# EAGLE design led_backpack_5947_alt (EAGLE 5.06)
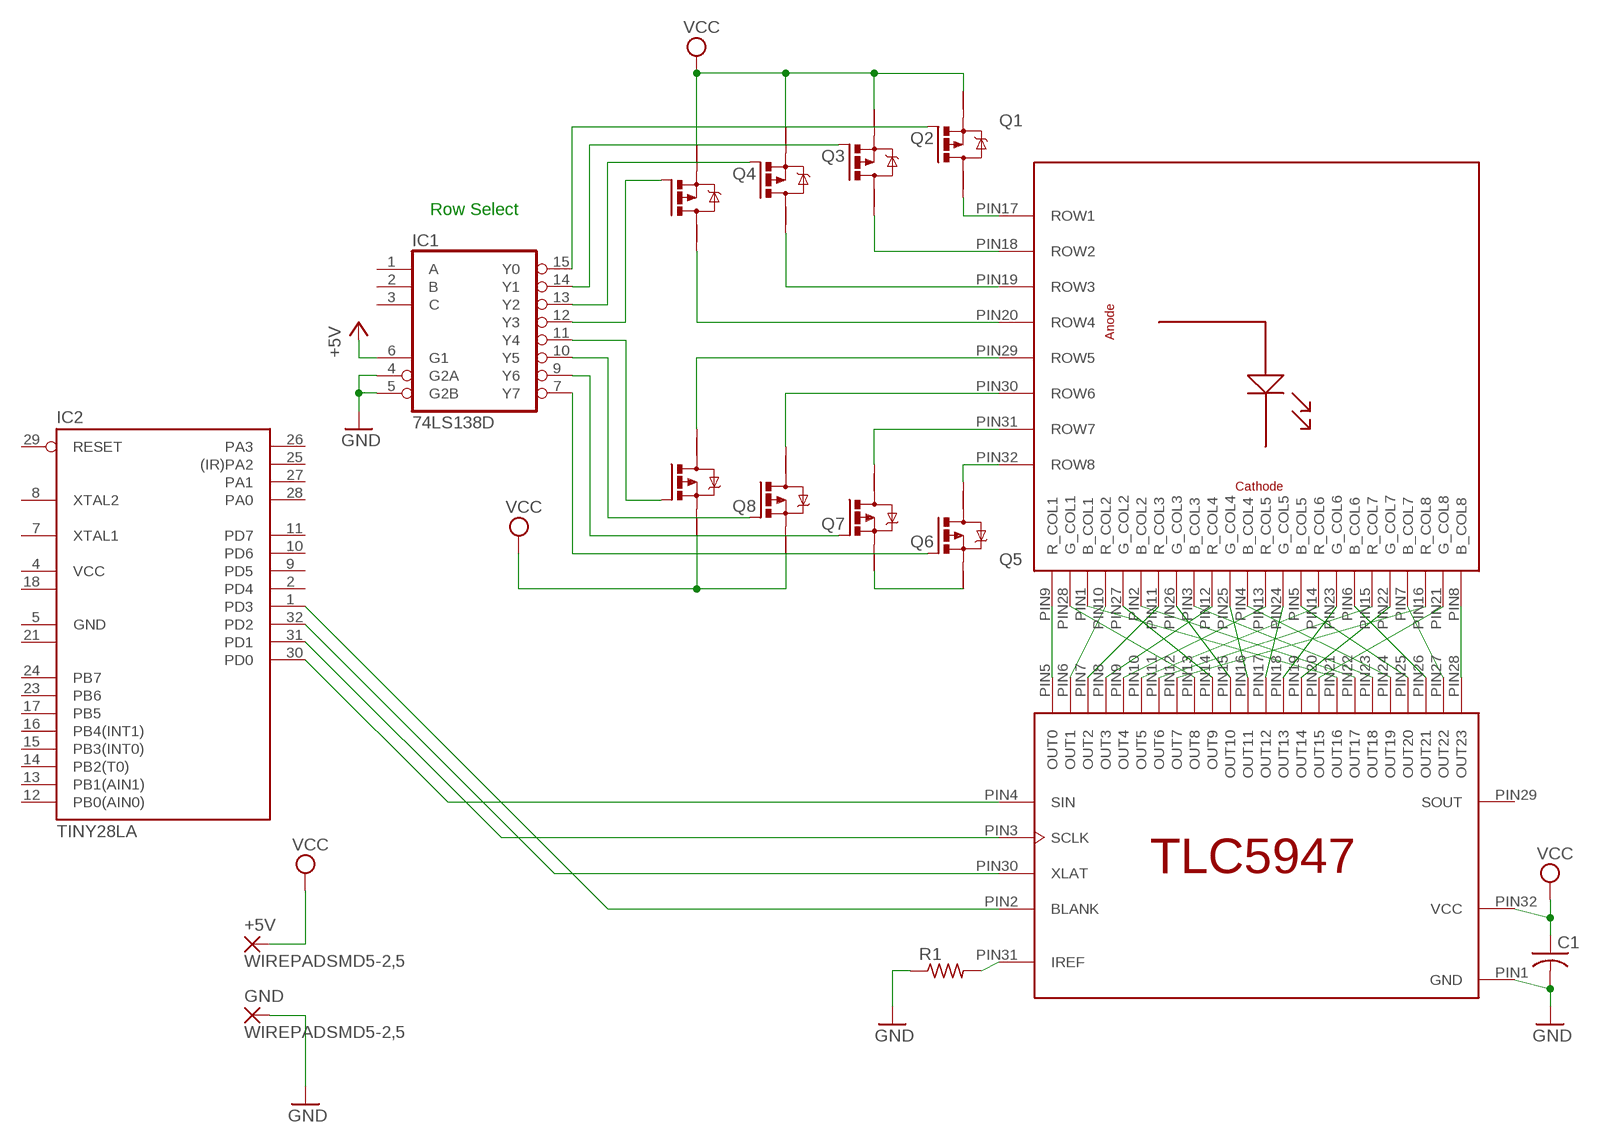
[diagram p0: schematic, sheet 1]

## Parts
+5V  WIREPADSMD5-2,5  [5-2,5]
C1  C-US075-042X103  [C075-042X103]
GND  WIREPADSMD5-2,5  [5-2,5]
IC1  74LS138D  [SO16]
IC2  TINY28LA  [TQFP32-08]
Q1  P-MOSFET-SO8  [SO-08]
Q2  P-MOSFET-SO8  [SO-08]
Q3  P-MOSFET-SO8  [SO-08]
Q4  P-MOSFET-SO8  [SO-08]
Q5  P-MOSFET-SO8  [SO-08]
Q6  P-MOSFET-SO8  [SO-08]
Q7  P-MOSFET-SO8  [SO-08]
Q8  P-MOSFET-SO8  [SO-08]
R1  R-US_0204/7  [0204/7]
U$1  TLC5947  [HTSSOP-DAP-32]
U$2  LEDSEE_LED_MATRIX_RGB  [LEDSEE_LED_MATRIX]

## Nets
+5V: IC1.6(G1)
GND: C1.2 GND.1(P) IC1.4(G2A) IC1.5(G2B) R1.1 U$1.PIN1(GND)
N$1: Q5.1(S) Q6.1(S)
N$2: U$1.PIN5(OUT0) U$2.PIN9(R_COL1)
N$3: U$1.PIN6(OUT1) U$2.PIN10(R_COL2)
N$4: U$1.PIN7(OUT2) U$2.PIN11(R_COL3)
N$5: U$1.PIN10(OUT5) U$2.PIN14(R_COL6)
N$6: U$1.PIN8(OUT3) U$2.PIN12(R_COL4)
N$7: U$1.PIN9(OUT4) U$2.PIN13(R_COL5)
N$8: U$1.PIN11(OUT6) U$2.PIN15(R_COL7)
N$9: U$1.PIN12(OUT7) U$2.PIN16(R_COL8)
N$10: U$1.PIN13(OUT8) U$2.PIN28(G_COL1)
N$11: U$1.PIN14(OUT9) U$2.PIN27(G_COL2)
N$12: U$1.PIN15(OUT10) U$2.PIN26(G_COL3)
N$13: U$1.PIN16(OUT11) U$2.PIN25(G_COL4)
N$14: U$1.PIN17(OUT12) U$2.PIN24(G_COL5)
N$15: Q1.5(D) U$2.PIN17(ROW1)
N$16: IC1.15(Y0) Q1.4(G)
N$17: IC1.14(Y1) Q2.4(G)
N$18: IC1.13(Y2) Q3.4(G)
N$19: IC1.12(Y3) Q4.4(G)
N$20: Q2.5(D) U$2.PIN18(ROW2)
N$21: Q3.5(D) U$2.PIN19(ROW3)
N$22: Q4.5(D) U$2.PIN20(ROW4)
N$23: Q5.5(D) U$2.PIN32(ROW8)
N$24: Q6.5(D) U$2.PIN31(ROW7)
N$25: Q7.5(D) U$2.PIN30(ROW6)
N$26: Q8.5(D) U$2.PIN29(ROW5)
N$27: IC1.7(Y7) Q5.4(G)
N$28: IC1.9(Y6) Q6.4(G)
N$29: U$1.PIN18(OUT13) U$2.PIN23(G_COL6)
N$30: U$1.PIN19(OUT14) U$2.PIN22(G_COL7)
N$31: U$1.PIN20(OUT15) U$2.PIN21(G_COL8)
N$32: U$1.PIN21(OUT16) U$2.PIN1(B_COL1)
N$33: U$1.PIN22(OUT17) U$2.PIN2(B_COL2)
N$34: U$1.PIN23(OUT18) U$2.PIN3(B_COL3)
N$35: U$1.PIN24(OUT19) U$2.PIN4(B_COL4)
N$36: U$1.PIN25(OUT20) U$2.PIN5(B_COL5)
N$37: U$1.PIN26(OUT21) U$2.PIN6(B_COL6)
N$38: U$1.PIN27(OUT22) U$2.PIN7(B_COL7)
N$39: IC1.10(Y5) Q7.4(G)
N$40: IC1.11(Y4) Q8.4(G)
N$41: R1.2 U$1.PIN31(IREF)
N$44: U$1.PIN28(OUT23) U$2.PIN8(B_COL8)
N$45: IC2.30(PD0) U$1.PIN4(SIN)
N$46: IC2.31(PD1) U$1.PIN3(SCLK)
N$47: IC2.32(PD2) U$1.PIN30(XLAT)
N$48: IC2.1(PD3) U$1.PIN2(BLANK)
VCC: +5V.1(P) C1.1 Q1.1(S) Q2.1(S) Q3.1(S) Q4.1(S) Q7.1(S) Q8.1(S) U$1.PIN32(VCC)
Unconnected: IC1.1(A) IC1.2(B) IC1.3(C) IC2.2(PD4) IC2.3(NC1) IC2.6(NC2) IC2.7(XTAL1) IC2.8(XTAL2) IC2.9(PD5) IC2.10(PD6) IC2.11(PD7) IC2.12(PB0(AIN0)) IC2.13(PB1(AIN1)) IC2.14(PB2(T0)) IC2.15(PB3(INT0)) IC2.16(PB4(INT1)) IC2.17(PB5) IC2.19(NC3) IC2.20(NC4) IC2.22(NC5) IC2.23(PB6) IC2.24(PB7) IC2.25((IR)PA2) IC2.26(PA3) IC2.27(PA1) IC2.28(PA0) IC2.29(RESET) Q1.2(S) Q1.3(S) Q1.6(D) Q1.7(D) Q1.8(D) Q2.2(S) Q2.3(S) Q2.6(D) Q2.7(D) Q2.8(D) Q3.2(S) Q3.3(S) Q3.6(D) Q3.7(D) Q3.8(D) Q4.2(S) Q4.3(S) Q4.6(D) Q4.7(D) Q4.8(D) Q5.2(S) Q5.3(S) Q5.6(D) Q5.7(D) Q5.8(D) Q6.2(S) Q6.3(S) Q6.6(D) Q6.7(D) Q6.8(D) Q7.2(S) Q7.3(S) Q7.6(D) Q7.7(D) Q7.8(D) Q8.2(S) Q8.3(S) Q8.6(D) Q8.7(D) Q8.8(D) U$1.PIN29(SOUT)

## Notes on the sheet
- Row Select

## Power pins joined to a net without a drawn wire
GND: IC1.8(GND) IC2.5(GND)
GND1: IC2.21(GND1)
VCC: IC1.16(VCC) IC2.4(VCC)
VCC1: IC2.18(VCC1)

## Library data of the parts
+5V GND = wirepad:WIREPAD: Wire PAD connect wire on PCB
C1 = resistor:C-US: CAPACITOR, American symbol
IC1 = 74xx-us:74*138: 3-line to 8-line DECODER/DEMULTIPLEXER
IC2 = atmel:TINY28*: MICROCONTROLLER 1.8 V 2 Kbytes FLASH
Q1-Q8 = transistor-power:P-MOSFET-SO8: P-Channel MOSFET Example: FDS4435A; P-Channel Logic Level PowerTrench® MOSFET FDS4465; P-Channel 1.8V Specified PowerTrench® MOSFET Source: www.fairchildsemi.com
R1 = resistor:R-US_: RESISTOR, American symbol
U$1 = custom-packages:TLC5947
U$2 = custom-packages:LEDSEE_LED_MATRIX_RGB

## Board
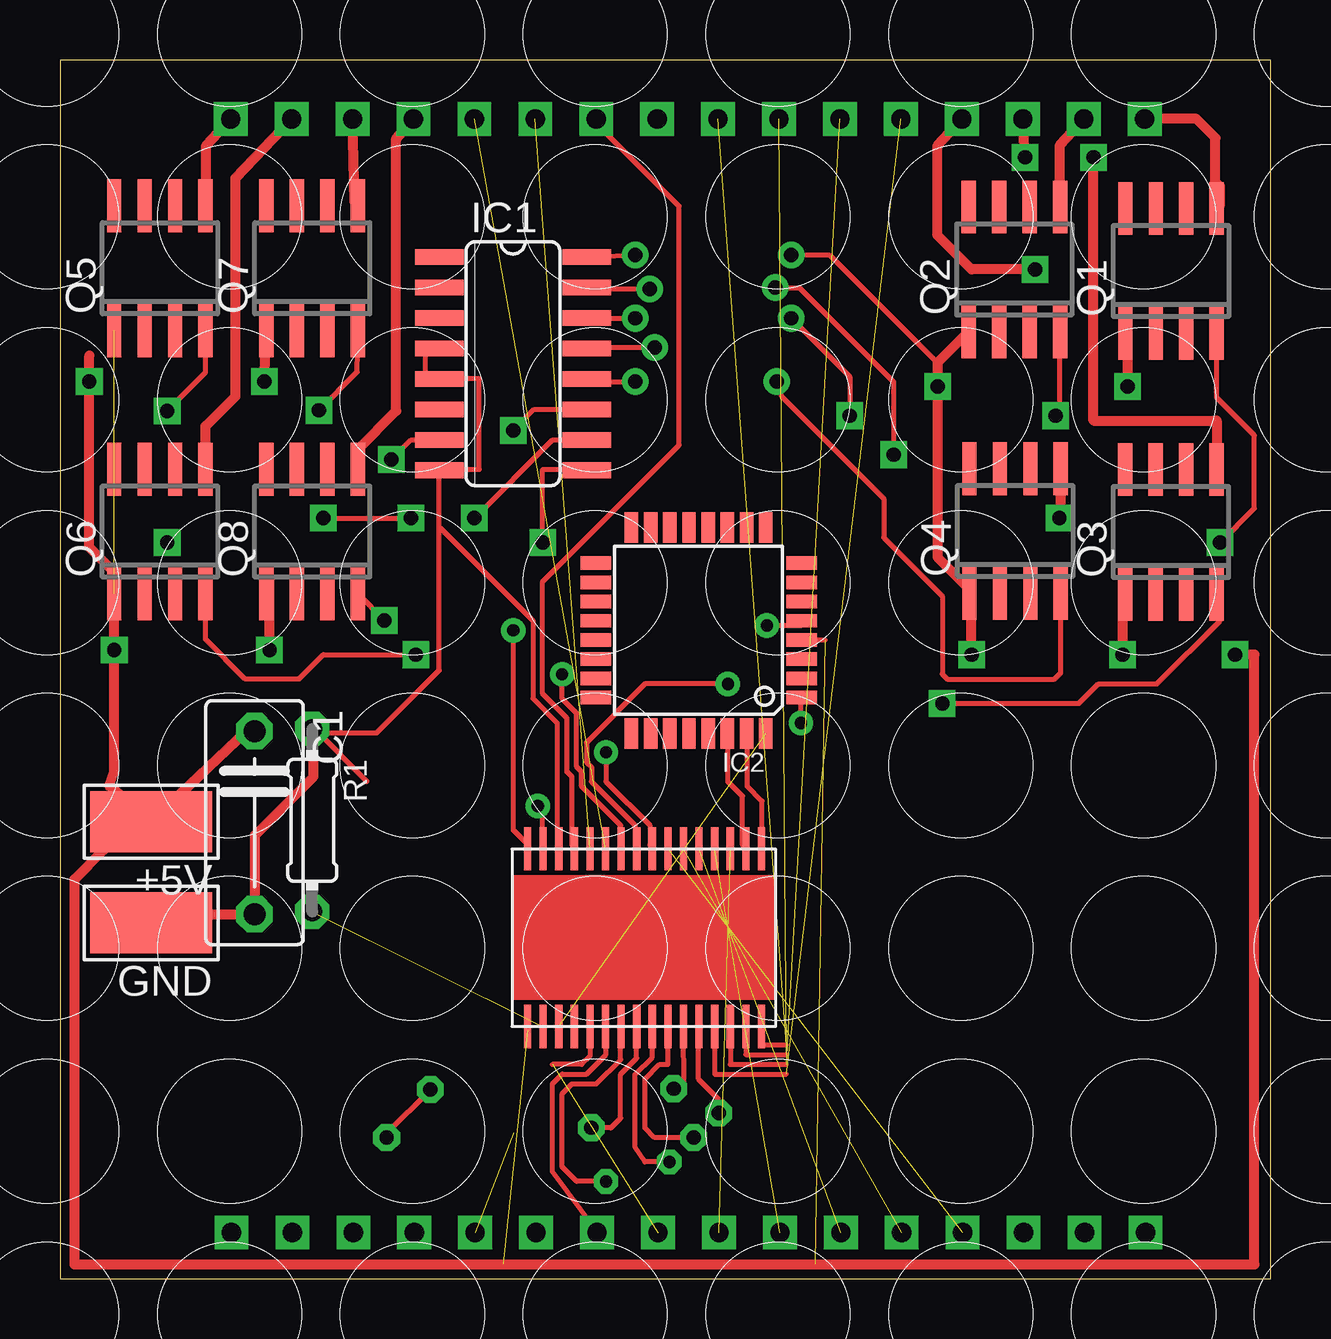
[diagram p1: board, top side]
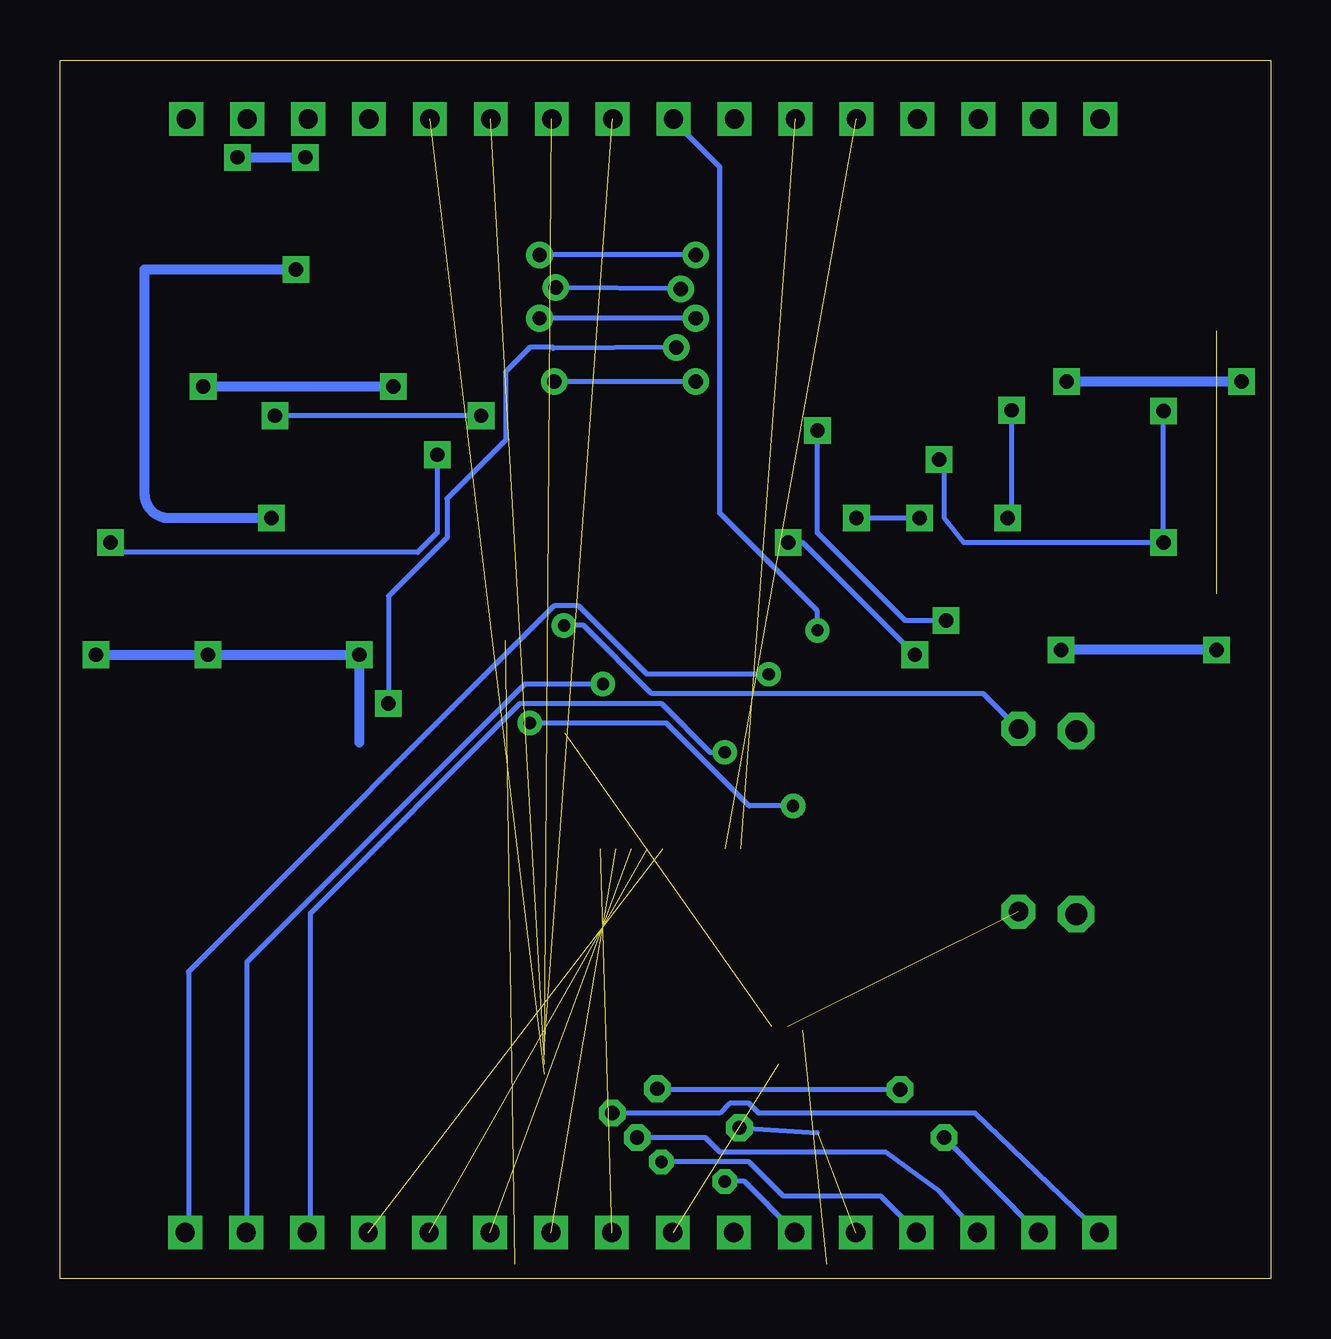
[diagram p2: board, bottom side, seen from below]

Size 50.47 x 50.79 mm. Coordinates in mm from the lower left corner, seen from the top.
Outline: 0,0 50.47,0 50.47,50.79 0,50.79 0,0
Copper layers (1*16): Top 0.035mm / dielectric 1.5mm / Bottom 0.035mm
Design rules "SparkFun": minimum track width 8mil, minimum drill 20mil, track to track 8mil, track to pad 8mil, pad to pad 8mil, via to via 8mil, smd to smd 8mil, copper to edge 10mil, drill to drill 8mil, minimum pad ring 12mil, minimum via ring 10mil, stop-mask expansion 4mil, vias tented up to drill 25mil, thermal gap 10mil

### Footprints (pad centres in the part's own frame; a part is rotated, then mirrored left to right if it is on the bottom)
5-2,5 = smd 2.54 x 5.08: 1 0,0
C075-042X103 = drill 0.914 octagon: 1 -3.81,0; 2 3.81,0
SO16 = smd 0.66 x 2.032: 1 -4.445,-3.073; 2 -3.175,-3.073; 3 -1.905,-3.073; 4 -0.635,-3.073; 5 0.635,-3.073; 6 1.905,-3.073; 7 3.175,-3.073; 8 4.445,-3.073; 9 4.445,3.073; 10 3.175,3.073; 11 1.905,3.073; 12 0.635,3.073; 13 -0.635,3.073; 14 -1.905,3.073; 15 -3.175,3.073; 16 -4.445,3.073
TQFP32-08 = smd 1.27 x 0.559: 1 -4.293,2.8; 2 -4.293,2; 3 -4.293,1.2; 4 -4.293,0.4; 5 -4.293,-0.4; 6 -4.293,-1.2; 7 -4.293,-2; 8 -4.293,-2.8; 17 4.293,-2.8; 18 4.293,-2; 19 4.293,-1.2; 20 4.293,-0.4; 21 4.293,0.4; 22 4.293,1.2; 23 4.293,2; 24 4.293,2.8 | smd 0.559 x 1.27: 9 -2.8,-4.293; 10 -2,-4.293; 11 -1.2,-4.293; 12 -0.4,-4.293; 13 0.4,-4.293; 14 1.2,-4.293; 15 2,-4.293; 16 2.8,-4.293; 25 2.8,4.293; 26 2,4.293; 27 1.2,4.293; 28 0.4,4.293; 29 -0.4,4.293; 30 -1.2,4.293; 31 -2,4.293; 32 -2.8,4.293
SO-08 = smd 0.6 x 2.2: 1 -1.905,-2.6; 2 -0.635,-2.6; 3 0.635,-2.6; 4 1.905,-2.6; 5 1.905,2.6; 6 0.635,2.6; 7 -0.635,2.6; 8 -1.905,2.6
0204/7 = drill 0.813 octagon: 1 -3.81,0; 2 3.81,0
HTSSOP-DAP-32 = smd 0.3 x 1.8: PIN1 -3.589,3.725; PIN2 -4.239,3.725; PIN3 4.861,3.725; PIN4 4.211,3.725; PIN5 3.561,3.725; PIN6 2.911,3.725; PIN7 2.261,3.725; PIN8 1.611,3.725; PIN9 0.961,3.725; PIN10 0.311,3.725; PIN11 -0.339,3.725; PIN12 -0.989,3.725; PIN13 -1.639,3.725; PIN14 -2.289,3.725; PIN15 -2.939,3.725; PIN16 -4.889,3.725; PIN17 4.861,-3.685; PIN18 4.211,-3.685; PIN19 3.561,-3.685; PIN20 2.911,-3.685; PIN21 2.261,-3.685; PIN22 1.611,-3.685; PIN23 0.961,-3.685; PIN24 0.311,-3.685; PIN25 -0.339,-3.685; PIN26 -0.989,-3.685; PIN27 -1.639,-3.685; PIN28 -2.289,-3.685; PIN29 -2.939,-3.685; PIN30 -3.589,-3.685; PIN31 -4.239,-3.685; PIN32 -4.889,-3.685
LEDSEE_LED_MATRIX = drill 0.8 square: PIN1 -18.164,-23.569; PIN2 -15.624,-23.569; PIN3 -13.084,-23.569; PIN4 -10.544,-23.569; PIN5 -8.004,-23.569; PIN6 -5.464,-23.569; PIN7 -2.924,-23.569; PIN8 -0.384,-23.569; PIN9 2.156,-23.569; PIN10 4.696,-23.569; PIN11 7.236,-23.569; PIN12 9.776,-23.569; PIN13 12.316,-23.569; PIN14 14.856,-23.569; PIN15 17.396,-23.569; PIN16 19.936,-23.569; PIN17 19.901,22.831; PIN18 17.361,22.831; PIN19 14.821,22.831; PIN20 12.281,22.831; PIN21 9.741,22.831; PIN22 7.201,22.831; PIN23 4.661,22.831; PIN24 2.121,22.831; PIN25 -0.419,22.831; PIN26 -2.959,22.831; PIN27 -5.499,22.831; PIN28 -8.039,22.831; PIN29 -10.579,22.831; PIN30 -13.119,22.831; PIN31 -15.659,22.831; PIN32 -18.199,22.831

### Placement (x,y rotation side)
+5V  3.81,19.05 90 top
C1  8.11,19.01 270 top
GND  3.81,14.83 90 top
IC1  18.88,38.13 270 top
IC2  26.62,27.03 180 top
Q1  46.31,42 0 top
Q2  39.78,42.06 0 top
Q3  46.31,31.13 0 top
Q4  39.81,31.16 0 top
Q5  4.17,42.11 0 top
Q6  4.17,31.14 0 top
Q7  10.52,42.11 0 top
Q8  10.52,31.14 0 top
R1  10.52,19.11 270 top
U$1  24.38,14.2 0 top
U$2  25.31,25.5 0 top

### Tracks (layer width: path | path; a pad name or v marks a point on that pad's centre or on a via)
GND  (via drill 0.51)
  Top 0.203: C1.2 8.19,15.28 | IC1.5 15.72,37.59 | 15.08,38.77 15.04,38.81 | 15.08,38.77 IC1.4 | 15.08,38.77 15.24,38.61 15.24,37.59 15.33,37.5 IC1.5 | IC1.5 17.48,37.5 17.48,33.73 15.81,33.73 IC1.8 15.81,31.29 | 12.8,20.73 10.61,22.92 R1.1 10.68,22.76 13.21,22.76 15.81,25.36 15.81,31.29 | v29.46,27.23 30.89,27.23 IC2.5 | U$1.PIN1 20.73,18.09 20.73,23.16 19.71,24.18 19.71,27.43 15.85,31.29 15.81,31.29
  Top 0.406: C1.2 3.61,15.2 GND.1 | 8.19,15.28 8.13,15.04 8.13,18.49 10.57,20.93 10.57,22.87 R1.1
  Bottom 0.203: v29.46,27.23 28.65,27.23 25.81,24.38 11.99,24.38 10.57,22.96 R1.1
N$1  (1 unrouted)
N$2  (1 unrouted)
N$3  (1 unrouted)
N$4  (1 unrouted)
N$5  (via drill 0.51)
  Top 0.203: v22.76,21.95 22.76,20.73 24.59,18.9 24.59,18.09 U$1.PIN10
  Bottom 0.203: v22.76,21.95 23.37,21.95 25.4,23.98 31.29,23.98 40.03,15.24 40.03,2.03 U$2.PIN14
N$6  (1 unrouted)
N$7  (1 unrouted)
N$8  (via drill 0.51)
  Top 0.203: v27.84,24.79 24.38,24.79 21.95,22.35 21.95,21.54 22.15,21.34 22.15,20.73 23.98,18.9 23.98,18.09 U$1.PIN11
  Bottom 0.203: v27.84,24.79 31.09,24.79 42.67,13.21 42.67,2.03 U$2.PIN15
N$9  (via drill 0.51)
  Top 0.203: v20.93,25.2 20.93,24.18 21.54,23.57 21.54,21.34 21.74,21.13 21.74,20.52 23.37,18.9 23.37,18.09 U$1.PIN12
  Bottom 0.203: v20.93,25.2 26.01,25.2 28.85,28.04 29.87,28.04 45.11,12.8 45.11,2.03 U$2.PIN16
N$10  (1 unrouted)
N$11  (1 unrouted)
N$12
  Top 0.203: U$1.PIN15 21.34,18.09 21.34,20.93 21.13,21.13 21.13,23.37 20.12,24.38 20.12,29.06 25.81,34.75 25.81,44.7 22.35,48.16 U$2.PIN26
N$13  (via drill 0.51)
  Top 0.203: v18.9,27.03 18.9,18.69 19.51,18.09 U$1.PIN16
  Bottom 0.203: v18.9,27.03 18.9,27.84 22.96,31.9 22.96,46.33 24.79,48.16 U$2.PIN25
N$14  (1 unrouted)
  Top 0.203: U$1.PIN17 29.24,9.75 30.28,9.75
N$15
  Top 0.406: U$2.PIN17 47.37,48.33 48.16,47.55 48.16,45.72 48.36,45.52 48.36,44.75 Q1.5
N$16  (via drill 0.6, 0.6 pad 0.25)
  Top 0.203: Q1.4 48.22,36.72 49.78,35.15 49.78,32.11 v48.36,30.68 | IC1.15 22.02,41.25 v24.59,41.25 | v34.75,34.34 34.75,37.39 30.83,41.31 v29.81,41.31
  Bottom 0.203: v48.36,30.68 47.95,30.28 35.56,30.28 34.75,31.09 v34.75,34.34 | v24.59,41.25 v29.81,41.31
N$17  (via drill 0.6, 0.6 pad 0.25)
  Top 0.203: Q2.4 41.68,36.14 v41.5,35.97 | IC1.14 v23.98,40.03 | v30.48,40.03 32.92,37.59 v32.92,35.97
  Bottom 0.203: v23.98,40.03 v30.48,40.03 | v32.92,35.97 v41.5,35.97
N$18  (via drill 0.6, 0.6 pad 0.25)
  Top 0.203: v36.78,23.98 42.47,23.98 43.28,24.79 45.72,24.79 48.36,27.43 48.36,28.38 Q3.4 | IC1.13 22,38.81 v24.79,38.81
  Bottom 0.203: v24.79,38.81 29.91,38.77 29.91,38.81 30.89,38.81 31.9,37.8 31.9,34.95 34.34,32.51 34.34,30.89 36.78,28.45 v36.78,23.98
N$19  (via drill 0.6)
  Top 0.203: Q4.4 41.72,25.26 41.45,24.99 36.98,24.99 36.78,25.2 36.78,28.45 34.34,30.89 34.34,32.51 30.07,36.78 v29.87,37.39 | IC1.12 21.96,37.39 v23.98,37.39
  Bottom 0.203: v23.98,37.39 v29.87,37.39
N$20
  Top 0.406: U$2.PIN18 41.68,47.25 Q2.5
N$21  (via drill 0.6)
  Top 0.406: U$2.PIN19 v40.22,46.75 v40.23,46.74 | Q3.5 48.21,35.76 43.08,35.76 v43.08,46.74
  Bottom 0.406: v43.08,46.74 v40.23,46.74
N$22  (via drill 0.6)
  Top 0.406: U$2.PIN20 36.58,47.23 36.58,43.48 38,42.06 v40.64,42.06 | v41.66,31.7 41.72,32.25 Q4.5
  Bottom 0.406: v40.64,42.06 46.94,42.06 46.94,32.72 arc-90 45.92,31.7 v41.66,31.7
N$23
  Top 0.406: Q5.5 6.07,45.7 6.1,45.72 6.1,47.23 U$2.PIN32
N$24
  Top 0.406: U$2.PIN31 7.32,45.88 7.32,36.78 6.07,35.53 Q6.5
N$25
  Top 0.406: U$2.PIN30 12.28,44.85 Q7.5
N$26
  Top 0.406: U$2.PIN29 14.02,47.51 14.02,36.17 12.42,34.57 Q8.5
N$27  (via drill 0.6)
  Top 0.203: Q5.4 6.07,37.77 v4.47,36.17 | IC1.7 | v13.82,34.14 14.64,34.96 IC1.7 | IC1.7 15.85,34.92
  Bottom 0.203: v4.47,36.17 v4.47,30.68 12.8,30.68 13.61,31.7 13.61,33.73 13.82,33.73 v13.82,34.14
N$28  (via drill 0.6 pad 0.25)
  Top 0.203: Q6.4 6.07,26.64 7.72,24.99 9.96,24.99 10.97,26.01 v14.83,26.01 | v20.12,30.68 20.12,33.73 21.91,33.73 IC1.9
  Bottom 0.203: v14.83,26.01 19.51,30.68 v20.12,30.68
N$29  (1 unrouted)
  Top 0.203: U$1.PIN18 28.59,9.35 30.28,9.35
N$30  (1 unrouted)
  Top 0.203: U$1.PIN19 27.94,8.94 30.28,8.94
N$31  (1 unrouted)
  Top 0.203: U$1.PIN20 27.29,8.53 30.28,8.53
N$32  (via drill 0.6)
  Top 0.203: v27.45,6.91 27.43,7.52 26.62,8.33 26.62,10.57 U$1.PIN21
  Bottom 0.203: v27.45,6.91 22.96,6.91 22.55,7.32 21.74,7.32 21.34,6.91 12.32,6.91 U$2.PIN1
N$33  (via drill 0.6)
  Top 0.203: U$1.PIN22 26.01,7.92 v25.58,7.92 | v13.61,5.89 13.61,6.07 v15.44,7.89
  Bottom 0.203: U$2.PIN2 v13.61,5.89 | v15.44,7.89 25.14,7.89 v25.58,7.92
N$34  (via drill 0.6)
  Top 0.203: U$1.PIN23 25.34,8.94 24.99,8.94 24.38,8.33 24.38,6.3 24.79,5.89 v26.42,5.89
  Bottom 0.203: U$2.PIN3 13.82,3.66 16.05,5.28 22.96,5.28 23.57,5.89 v26.42,5.89
N$35  (via drill 0.51)
  Top 0.203: U$1.PIN24 24.69,9.24 23.98,8.53 23.98,5.49 24.38,4.88 v25.4,4.88
  Bottom 0.203: v25.4,4.88 21.74,4.88 20.32,3.45 16.26,3.45 14.83,2.03 U$2.PIN4
N$36  (via drill 0.6)  (1 unrouted)
  Top 0.203: U$1.PIN25 24.04,9.2 23.37,8.53 23.37,6.71 22.96,6.3 v22.15,6.3
  Bottom 0.203: v22.15,6.3 18.9,6.1
N$37  (via drill 0.51)
  Top 0.203: v22.76,4.06 21.54,4.06 20.93,4.67 20.93,7.72 21.34,8.13 22.35,8.13 23.37,9.14 23.37,10.36 U$1.PIN26
  Bottom 0.203: v22.76,4.06 21.95,4.06 19.91,2.03 U$2.PIN6
N$38
  Top 0.203: U$1.PIN27 22.76,9.35 21.95,8.53 20.93,8.53 20.52,8.13 20.52,4.47 22.35,2.03 U$2.PIN7
N$39  (via drill 0.6)
  Top 0.203: Q7.4 12.39,37.8 v10.79,36.2 | v10.97,31.7 v14.63,31.7 | v17.27,31.7 20.53,34.96 IC1.10
  Bottom 0.203: 10.79,31.7 v10.79,36.2 | v14.63,31.7 v17.27,31.7
  Bottom 0.305: v10.97,31.7 10.79,31.7
N$40  (via drill 0.6)
  Top 0.203: Q8.4 v13.53,27.43 | IC1.11 19.77,36.23 v18.9,35.36
  Bottom 0.203: v18.9,35.36 18.9,31.09 15.24,27.43 v13.53,27.43
N$41  (1 unrouted)
N$44  (1 unrouted)
  Top 0.203: U$1.PIN28 22.09,9.29 21.74,8.94 20.52,8.94
N$45
  Top 0.203: IC2.30 27.84,22.55 27.84,20.73 28.45,20.12 28.45,18.09 U$1.PIN4
N$46
  Top 0.203: IC2.31 28.65,22.55 28.65,20.52 29.26,19.91 29.26,18.09 U$1.PIN3
N$47  (1 unrouted)
N$48  (via drill 0.51)
  Top 0.203: v30.89,23.16 30.89,24.18 IC2.1 | v19.91,19.71 20.12,19.51 20.12,18.09 U$1.PIN2
  Bottom 0.203: v30.89,23.16 25.2,23.16 21.74,19.71 v19.91,19.71
VCC  (via drill 0.6, 0.6 pad 0.25)  (2 unrouted)
  Top 0.203: IC1.16 v23.98,42.67 | v30.48,42.67 32.07,42.67 36.58,38.17 | 31.9,26.62 31.09,26.62 IC2.4 | 19.51,10.36 U$1.PIN32 | 1.83,17.88 3.25,19.3 +5V.1
  Top 0.406: 2.26,21.13 2.06,20.55 +5V.1 7.79,22.82 C1.1 | 2.26,21.13 v2.26,26.21 2.26,29.44 1.22,30.48 v1.22,37.39 1.22,38.47 | v8.74,26.21 8.74,29.23 Q8.1 | v8.52,37.39 Q7.1 | 1.83,17.88 0.61,16.66 0.61,0.61 18.49,0.61 31.5,0.61 49.78,0.61 49.78,26.01 v48.97,26.01 | v38,26.01 38,27.64 37.91,27.64 Q4.1 37.91,28.74 36.58,30.07 v36.58,37.19 36.58,38.17 Q2.1 | Q3.1 44.3,28.53 v44.3,26.01 | Q1.1 44.5,39.3 v44.5,37.19 | 2.26,21.13 2.26,21.4
  Bottom 0.203: v23.98,42.67 v30.48,42.67
  Bottom 0.406: v2.26,26.21 v8.74,26.21 | v1.22,37.39 v8.52,37.39 | v48.97,26.01 v44.3,26.01 v38,26.01 38,22.35 | v36.58,37.19 v44.5,37.19